# EAGLE schematic C1 (EAGLE 7.5.0)

## Sheet 1 of 2: Schematic1/2
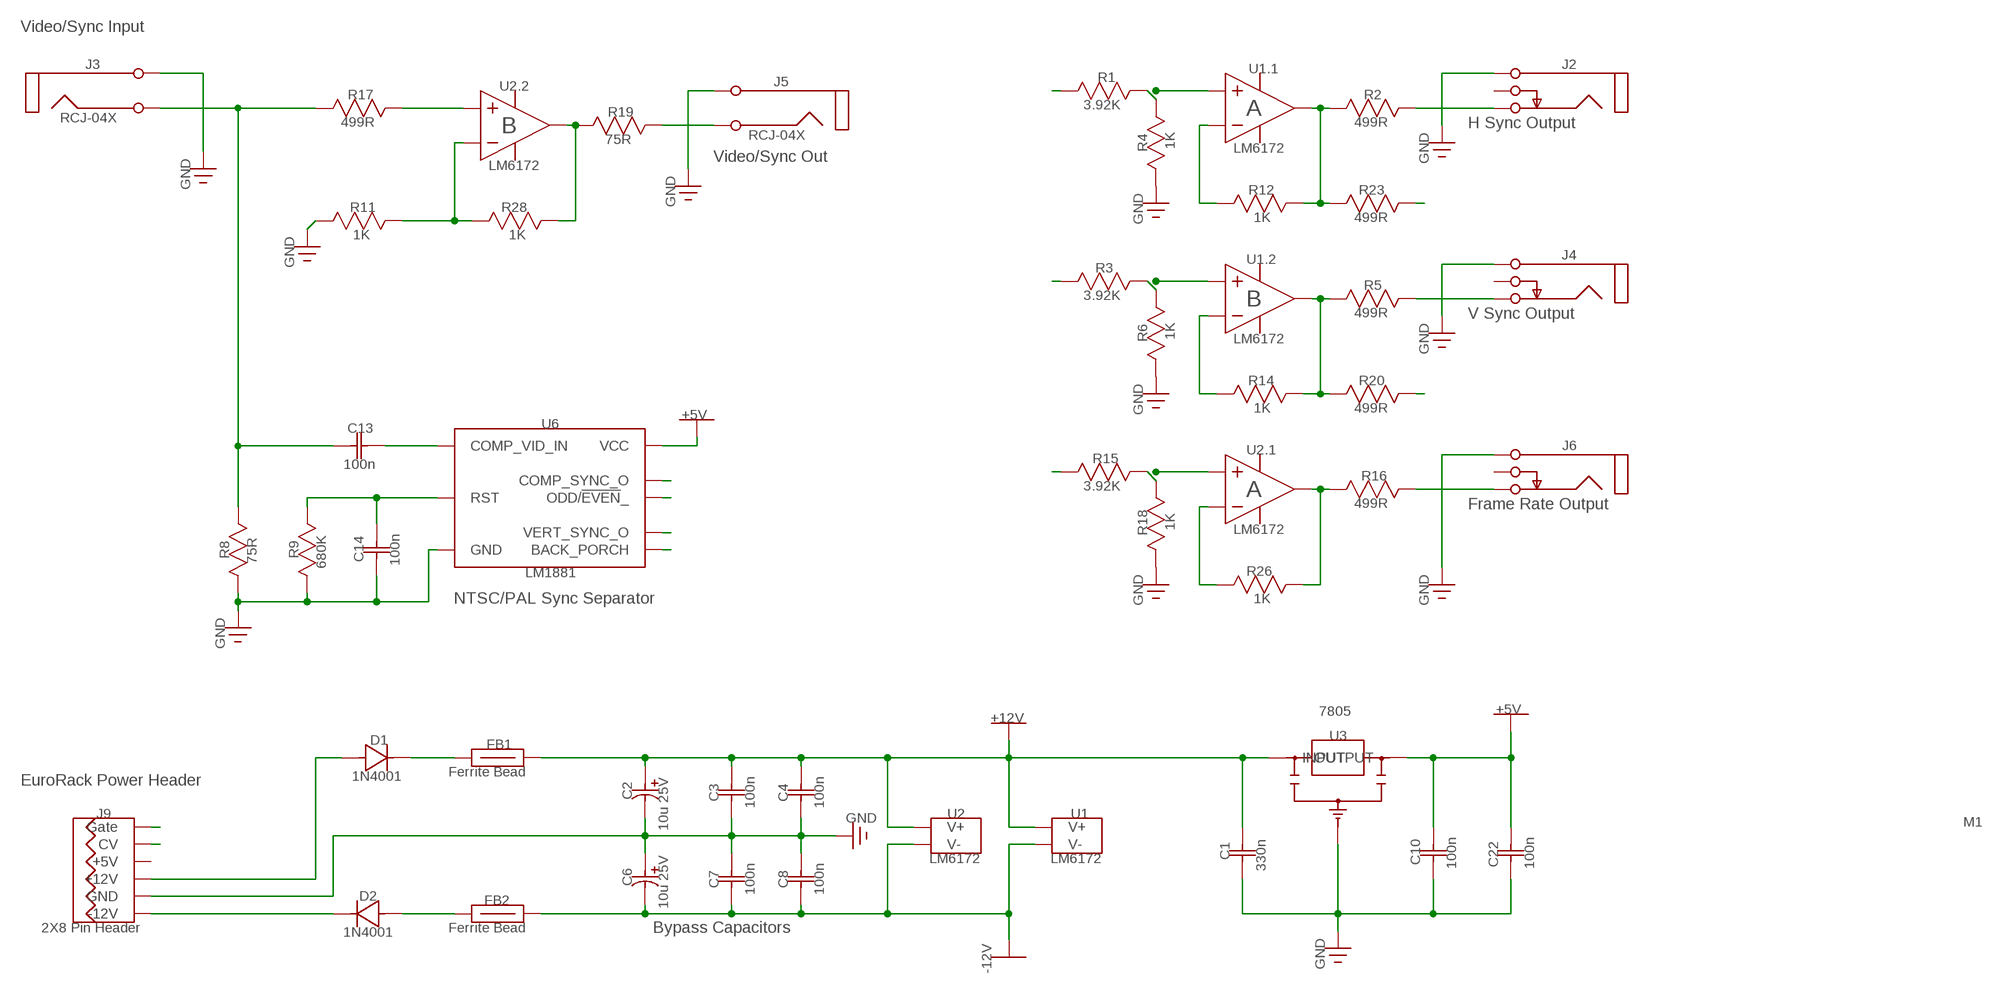
[diagram p0: schematic, sheet 1]

### Parts
C1  330n  CAP100  [CAP-2.54/6.6X3]
C2  10u 25V  EC80-5  [CAPPR-2/5.08]
C3  100n  CAP100  [CAP-2.54/6.6X3]
C4  100n  CAP100  [CAP-2.54/6.6X3]
C6  10u 25V  EC80-5  [CAPPR-2/5.08]
C7  100n  CAP100  [CAP-2.54/6.6X3]
C8  100n  CAP100  [CAP-2.54/6.6X3]
C10  100n  CAP100  [CAP-2.54/6.6X3]
C13  100n  CAP100  [CAP-2.54/6.6X3]
C14  100n  CAP100  [CAP-2.54/6.6X3]
C22  100n  CAP100  [CAP-2.54/6.6X3]
D1  1N4001  [DO-41]
D2  1N4001  [DO-41]
FB1  68R  FERRITE_BEAD  [FB-10.16/4.45X3.5]
FB2  68R  FERRITE_BEAD  [FB-10.16/4.45X3.5]
J2  3.5MM_JACK  [PJ302M]
J3  RCJ-04X  [RCJ-04X]
J4  3.5MM_JACK  [PJ302M]
J5  RCJ-04X_23  [RCJ-04X]
J6  3.5MM_JACK  [PJ302M]
J9  2X8_PIN_HEADER  [IDC16M]
M1  KEYSTONE621  [KEYSTONE621]
R1  3.92K  RES300  [RES-7.62/5.1X2.5]
R2  499R  RES300  [RES-7.62/5.1X2.5]
R3  3.92K  RES300  [RES-7.62/5.1X2.5]
R4  1K  RES300  [RES-7.62/5.1X2.5]
R5  499R  RES300  [RES-7.62/5.1X2.5]
R6  1K  RES300  [RES-7.62/5.1X2.5]
R8  75R  RES300  [RES-7.62/5.1X2.5]
R9  680K  RES300  [RES-7.62/5.1X2.5]
R11  1K  RES300  [RES-7.62/5.1X2.5]
R12  1K  RES300  [RES-7.62/5.1X2.5]
R14  1K  RES300  [RES-7.62/5.1X2.5]
R15  3.92K  RES300  [RES-7.62/5.1X2.5]
R16  499R  RES300  [RES-7.62/5.1X2.5]
R17  499R  RES300  [RES-7.62/5.1X2.5]
R18  1K  RES300  [RES-7.62/5.1X2.5]
R19  75R  RES300  [RES-7.62/5.1X2.5]
R20  499R  RES300  [RES-7.62/5.1X2.5]
R23  499R  RES300  [RES-7.62/5.1X2.5]
R26  1K  RES300  [RES-7.62/5.1X2.5]
R28  1K  RES300  [RES-7.62/5.1X2.5]
U1  LM6172  [DIP-8]
U2  LM6172  [DIP-8]
U3  7805  [TO-220H]
U6  LM1881  [DIP-8_12]

### Nets
0V: C1.2 C2.2(MINUS) C3.2 C4.2 C6.1(PLUS) C7.1 C8.1 C10.2 C14.1 C22.2 J2.1A(Sleeve) J2.1B(Sleeve) J3.1(Sleeve) J4.1A(Sleeve) J4.1B(Sleeve) J5.1(Sleeve) J6.1A(Sleeve) J6.1B(Sleeve) J9.3(GND) J9.4(GND) J9.5(GND) R4.1(A) R6.1(A) R8.1(A) R9.1(A) R11.1(A) R18.1(A) U3.2(GND) U6.4(GND) ; supply symbol labelled GND ; also sheet 2
+5V: C10.1 C22.1 U3.3(OUTPUT) U6.8(VCC) ; also sheet 2
+12V: C1.1 C2.1(PLUS) C3.1 C4.1 FB1.2 U1.8(VCC_AND_GND:V+) U2.8(VCC_AND_GND:V+) U3.1(INPUT)
-12V: C6.2(MINUS) C7.2 C8.2 FB2.2 U1.4(VCC_AND_GND:V-) U2.4(VCC_AND_GND:V-)
ATMEGA88_HSYNC_INV: R1.1(A) ; also sheet 2
ATMEGA88_ODDEVEN: R15.1(A) ; also sheet 2
ATMEGA88_VSYNC_INV: R3.1(A) ; also sheet 2
HSYNC_BUS_OUT: J9.13(CV) J9.14(CV) R23.2(B)
LM1881_BURSTGATE: U6.5(BACK_PORCH)
LM1881_CSYNC: U6.1(COMP_SYNC_O) ; also sheet 2
LM1881_ODDEVEN: U6.7(ODD/!EVEN!_) ; also sheet 2
LM1881_VSYNC: U6.3(VERT_SYNC_O) ; also sheet 2
Net_0: J5.2(Tip) R19.2(B)
Net_1: D2.2(A) FB2.1
Net_2: D1.1(K) FB1.1
Net_3: R14.1(A) U1.6(PART_2:IN-)
Net_4: C13.2 U6.2(COMP_VID_IN)
Net_5: D2.1(K) J9.1(-12V) J9.2(-12V)
Net_6: R3.2(B) R6.2(B) U1.5(PART_2:IN+)
Net_7: J4.3A(Tip) J4.3B(Tip) R5.2(B)
Net_9: R1.2(B) R4.2(B) U1.3(PART_1:IN+)
Net_11: J2.3A(Tip) J2.3B(Tip) R2.2(B)
Net_12: R5.1(A) R14.2(B) R20.1(A) U1.7(PART_2:OUT)
Net_14: R11.2(B) R28.1(A) U2.6(PART_2:IN-)
Net_19: R15.2(B) R18.2(B) U2.3(PART_1:IN+)
Net_20: J6.3A(Tip) J6.3B(Tip) R16.2(B)
Net_21: R26.1(A) U2.2(PART_1:IN-)
Net_22: R16.1(A) R26.2(B) U2.1(PART_1:OUT)
Net_24: R17.2(B) U2.5(PART_2:IN+)
Net_27: R19.1(A) R28.2(B) U2.7(PART_2:OUT)
Net_33: D1.2(A) J9.9(+12V) J9.10(+12V)
Net_34: C13.1 J3.2(Tip) R8.2(B) R17.1(A)
Net_35: C14.2 R9.2(B) U6.6(RST)
Net_52: R12.1(A) U1.2(PART_1:IN-)
Net_53: R2.1(A) R12.2(B) R23.1(A) U1.1(PART_1:OUT)
VSYNC_BUS_OUT: J9.15(Gate) J9.16(Gate) R20.2(B)
Unconnected: J2.2A(Switch) J2.2B(Switch) J4.2A(Switch) J4.2B(Switch) J6.2A(Switch) J6.2B(Switch) J9.11(+5V) J9.12(+5V)

### Notes on the sheet
- Video/Sync Input
- J3 | J2
- U1.1
- R1
- J5
- U2.2
- R17 | 3.92K | A | R2
- RCJ-04X
- 499R | B | R19 | 499R | H Sync Output
- RCJ-04X
- 75R
- LM6172
- Video/Sync Out | R4 | 1K
- LM6172 | GND
- GND
- R12 | R23
- GND
- R11 | R28 | 1K | 499R
- GND
- 1K | 1K
- J4
- GND | U1.2
- R3
- 3.92K | B | R5
- 499R | V Sync Output
- LM6172
- R6 | 1K
- GND
- R14 | R20
- 1K | 499R
- GND
- +5V
- U6
- C13
- J6
- U2.1
- 100n
- R15
- 3.92K | A | R16
- 499R | Frame Rate Output
- LM6172
- 1K
- R18
- R8 | R9 | C14
- 75R | 100n | LM1881
- 680K
- R26
- NTSC/PAL Sync Separator | 1K
- GND | GND
- GND
- 7805
- +5V
- +12V
- U3
- D1
- FB1
- Ferrite Bead
- EuroRack Power Header | 1N4001
- C2 | C3 | C4
- 100n | 100n
- J9 | U2 | U1
- GND | M1
- 10u 25V
- LM6172 | LM6172
- C1
- C10 | C22
- 330n | 100n | 100n
- C6 | C7 | C8
- 100n | 100n
- D2
- FB2 | 10u 25V
- 2X8 Pin Header | Ferrite Bead | Bypass Capacitors
- 1N4001
- GND
- -12V

## Sheet 2 of 2: Schematic2/2
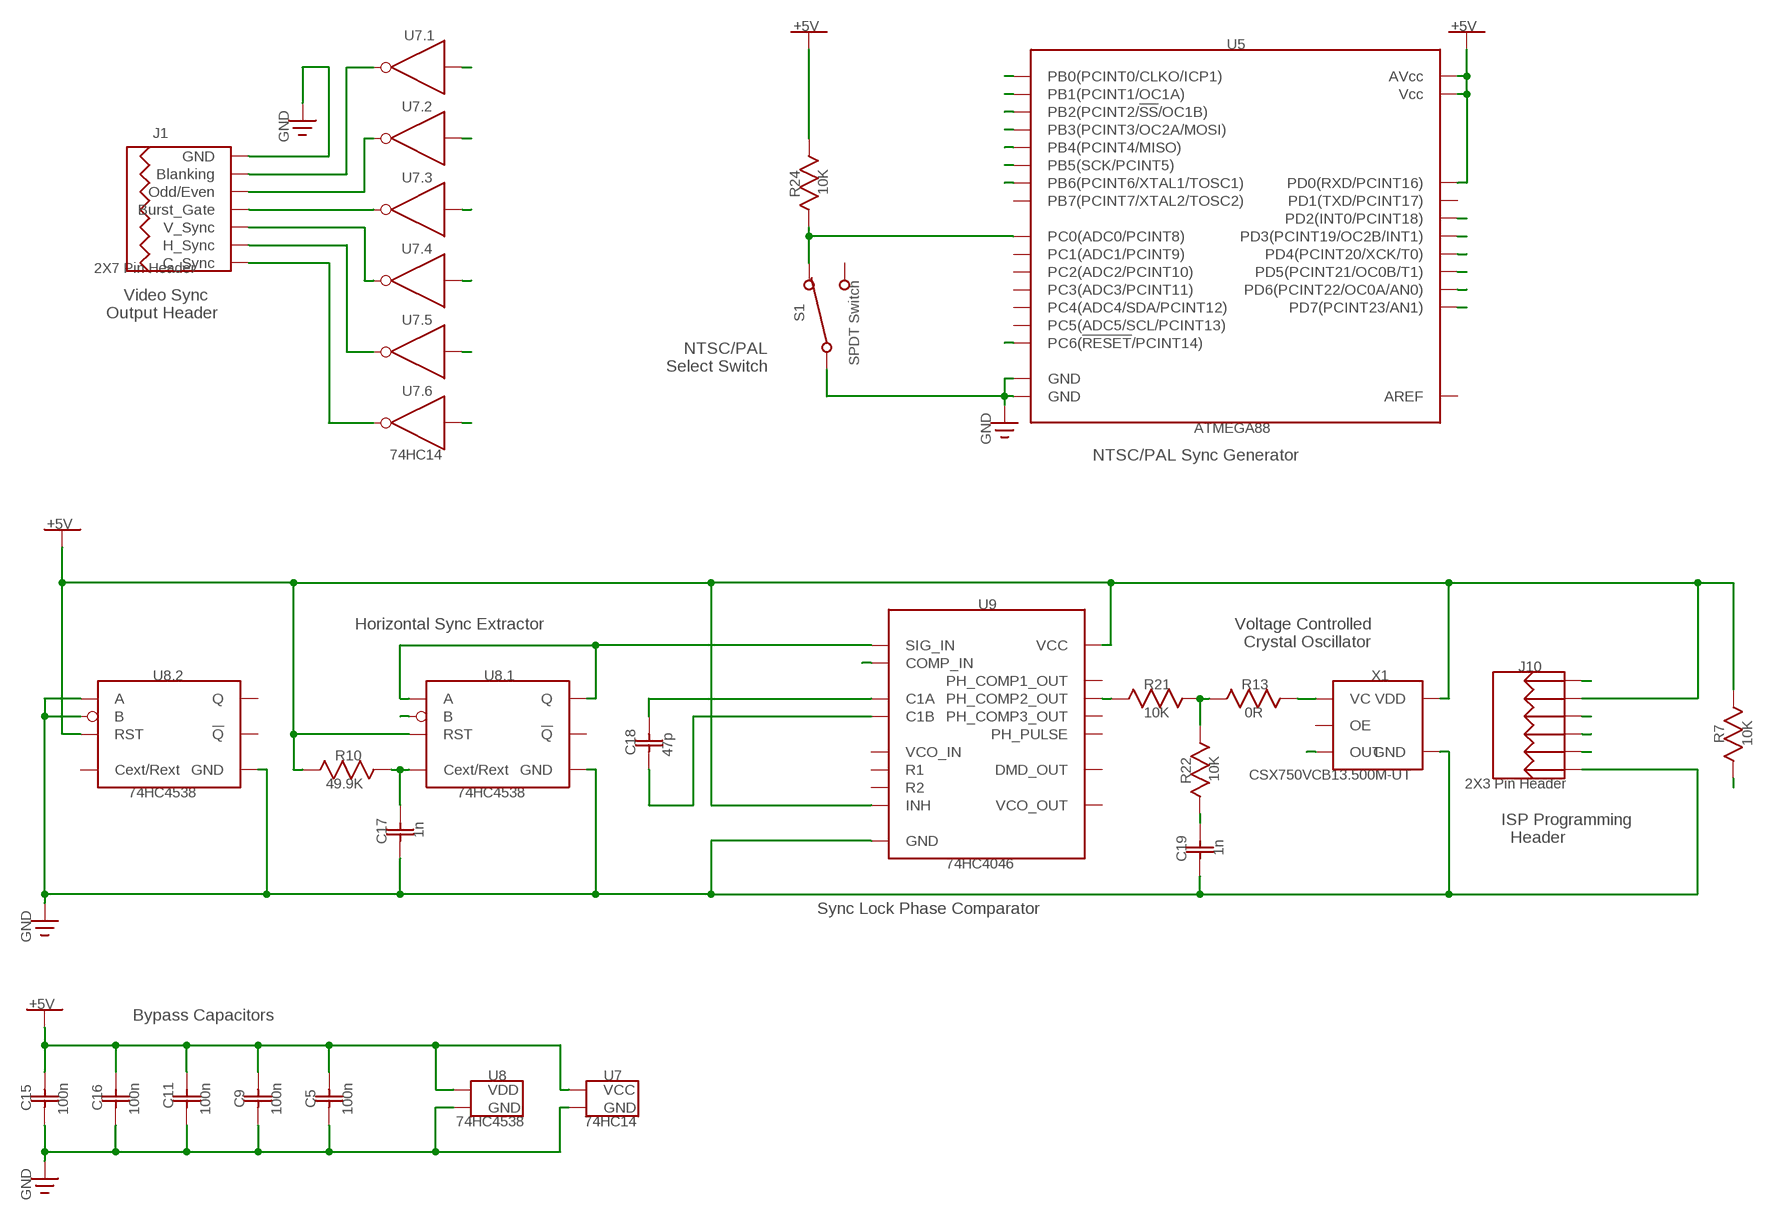
[diagram p1: schematic, sheet 2]

### Parts
C5  100n  CAP100  [CAP-2.54/6.6X3]
C9  100n  CAP100  [CAP-2.54/6.6X3]
C11  100n  CAP100  [CAP-2.54/6.6X3]
C15  100n  CAP100  [CAP-2.54/6.6X3]
C16  100n  CAP100  [CAP-2.54/6.6X3]
C17  1n  CAP100  [CAP-2.54/6.6X3]
C18  47p  CAP100  [CAP-2.54/6.6X3]
C19  1n  CAP100  [CAP-2.54/6.6X3]
J1  2X7_PIN_HEADER  [IDC14M]
J10  2X3_PIN_HEADER  [HDR-2X3T/2.54X2.54/8X5]
R7  10K  RES300  [RES-7.62/5.1X2.5]
R10  49.9K  RES300  [RES-7.62/5.1X2.5]
R13  0R  RES300  [RES-7.62/5.1X2.5]
R21  10K  RES300  [RES-7.62/5.1X2.5]
R22  10K  RES300  [RES-7.62/5.1X2.5]
R24  10K  RES300  [RES-7.62/5.1X2.5]
S1  SPDT_SWITCH  [10TF230-DIY]
U5  ATMEGA88  [DIP-28]
U7  74HC14  [DIP-14]
U8  74HC4538  [DIP-16]
U9  74HC4046  [DIP-16]
X1  CSX750VCB13.500M-UT  [CSX-750V]

### Nets
0V: C5.2 C9.2 C11.2 C15.2 C16.2 C17.2 C19.2 J1.1(GND) J1.2(GND) J10.6 S1.2(C1) S1.2B(C1) U5.8(GND) U5.22(GND) U7.7(VCC_AND_GND:GND) U8.1(PART_1:GND) U8.8(VCC_AND_GND:GND) U8.11(PART_2:B) U8.12(PART_2:A) U8.15(PART_2:GND) U9.8(GND) X1.3(GND) ; supply symbol labelled GND ; also sheet 1
+5V: C5.1 C9.1 C11.1 C15.1 C16.1 J10.2 R7.2(B) R10.2(B) R24.1(A) U5.2(PD0(RXD/PCINT16)) U5.7(Vcc) U5.20(AVcc) U7.14(VCC_AND_GND:VCC) U8.3(PART_1:RST) U8.13(PART_2:RST) U8.16(VCC_AND_GND:VDD) U9.5(INH) U9.16(VCC) X1.6(VDD) ; also sheet 1
ATMEGA88_BLANKING_INV: U5.11(PD5(PCINT21/OC0B/T1)) U7.1(PART_1:A)
ATMEGA88_BURSTGATE_INV: U5.5(PD3(PCINT19/OC2B/INT1)) U7.5(PART_3:A)
ATMEGA88_CSYNC_INV: U5.16(PB2(PCINT2/!SS!/OC1B)) U7.13(PART_6:A)
ATMEGA88_HSYNC_INV: U5.15(PB1(PCINT1/OC1A)) U7.11(PART_5:A) U9.3(COMP_IN) ; also sheet 1
ATMEGA88_MISO: J10.1 U5.18(PB4(PCINT4/MISO))
ATMEGA88_MOSI: J10.4 U5.17(PB3(PCINT3/OC2A/MOSI))
ATMEGA88_ODDEVEN: U5.12(PD6(PCINT22/OC0A/AN0)) ; also sheet 1
ATMEGA88_ODDEVEN_INV: U5.14(PB0(PCINT0/CLKO/ICP1)) U7.3(PART_2:A)
ATMEGA88_RESET: J10.5 R7.1(A) U5.1(PC6(!RESET!/PCINT14))
ATMEGA88_SCK: J10.3 U5.19(PB5(SCK/PCINT5))
ATMEGA88_VSYNC_INV: U5.13(PD7(PCINT23/AN1)) U7.9(PART_4:A) ; also sheet 1
CLOCK_OUT: U5.9(PB6(PCINT6/XTAL1/TOSC1)) X1.4(OUT)
LM1881_CSYNC: U8.5(PART_1:B) ; also sheet 1
LM1881_ODDEVEN: U5.6(PD4(PCINT20/XCK/T0)) ; also sheet 1
LM1881_VSYNC: U5.4(PD2(INT0/PCINT18)) ; also sheet 1
Net_15: J1.3(Blanking) J1.4(Blanking) U7.2(PART_1:Y)
Net_16: J1.5(Odd/Even) J1.6(Odd/Even) U7.4(PART_2:Y)
Net_40: U8.4(PART_1:A) U8.6(PART_1:Q) U9.14(SIG_IN)
Net_41: C17.1 R10.1(A) U8.2(PART_1:Cext/Rext)
Net_42: C18.1 U9.6(C1A)
Net_43: C18.2 U9.7(C1B)
Net_44: C19.1 R22.2(B)
Net_45: R13.2(B) R21.2(B) R22.1(A)
Net_46: R21.1(A) U9.13(PH_COMP2_OUT)
Net_47: J1.7(Burst_Gate) J1.8(Burst_Gate) U7.6(PART_3:Y)
Net_48: J1.9(V_Sync) J1.10(V_Sync) U7.8(PART_4:Y)
Net_49: J1.11(H_Sync) J1.12(H_Sync) U7.10(PART_5:Y)
Net_50: J1.13(C_Sync) J1.14(C_Sync) U7.12(PART_6:Y)
Net_58: R13.1(A) X1.1(VC)
Net_62: R24.2(B) S1.1(C3) S1.1B(C3) U5.23(PC0(ADC0/PCINT8))
Unconnected: S1.3(C2) S1.3B(C2) U5.3(PD1(TXD/PCINT17)) U5.10(PB7(PCINT7/XTAL2/TOSC2)) U5.21(AREF) U5.24(PC1(ADC1/PCINT9)) U5.25(PC2(ADC2/PCINT10)) U5.26(PC3(ADC3/PCINT11)) U5.27(PC4(ADC4/SDA/PCINT12)) U5.28(PC5(ADC5/SCL/PCINT13)) U8.7(PART_1:!Q) U8.9(PART_2:!Q) U8.10(PART_2:Q) U8.14(PART_2:Cext/Rext) U9.1(PH_PULSE) U9.2(PH_COMP1_OUT) U9.4(VCO_OUT) U9.9(VCO_IN) U9.10(DMD_OUT) U9.11(R1) U9.12(R2) U9.15(PH_COMP3_OUT) X1.5(OE)

### Notes on the sheet
- +5V | +5V
- U7.1
- U5
- U7.2
- J1 | GND
- U7.3
- R24 | 10K
- U7.4
- 2X7 Pin Header
- Video Sync
- Output Header
- U7.5 | S1
- NTSC/PAL
- Select Switch
- SPDT Switch
- U7.6
- ATMEGA88
- GND
- 74HC14 | NTSC/PAL Sync Generator
- +5V
- U9
- Horizontal Sync Extractor | Voltage Controlled
- Crystal Oscillator
- J10
- U8.2 | U8.1 | X1
- R21 | R13
- 10K | 0R
- R7 | 10K
- C18 | 47p
- R10
- CSX750VCB13.500M-UT
- 49.9K | 10K | 2X3 Pin Header
- 74HC4538 | 74HC4538 | R22
- ISP Programming
- Header
- 1n
- C17
- 74HC4046 | 1n
- C19
- Sync Lock Phase Comparator
- GND
- +5V | Bypass Capacitors
- U8 | U7
- C15 | C16 | C11 | C9 | C5
- 100n | 100n | 100n | 100n | 100n | 74HC4538 | 74HC14
- GND

## Library data of the parts
C1 = common:CAP100
C2 C6 = common:EC80-5
C3-C5 C7-C11 C13-C19 C22 = common:CAP100; VALUE: 330n
D1 D2 = common:1N4001
FB1 FB2 = common:FERRITE_BEAD; MANUFACTURER: Fair-Rite
J1 = common:2X7_PIN_HEADER
J2 J4 J6 = common:3.5MM_JACK; DATASHEET: http://www.thonk.co.uk/shop/pj302m/
J3 = common:RCJ-04X
J5 = common:RCJ-04X_23
J9 = common:2X8_PIN_HEADER
J10 = common:2X3_PIN_HEADER; DATASHEET: http://datasheets.diptrace.com\con_headers\901310126_sd.pdf; MANUFACTURER: Molex
M1 = common:KEYSTONE621
R1 R3 R15 = common:RES300
R2 R4-R14 R16-R24 R26 R28 = common:RES300; VALUE: 3.92K
S1 = common:SPDT_SWITCH
U1 U2 = common:LM6172; DATASHEET: http://datasheets.diptrace.com\ti\TL07x.pdf; MANUFACTURER: Texas Instruments
U3 = common:7805; MANUFACTURER: Atmel
U5 = common:ATMEGA88; MANUFACTURER: Atmel
U6 = common:LM1881; MANUFACTURER: National Semiconductor
U7 = common:74HC14; MANUFACTURER: National Semiconductor
U8 = common:74HC4538; MANUFACTURER: Motorola
U9 = common:74HC4046; DATASHEET: http://datasheets.diptrace.com\fairchild\MM74HC4046.pdf; MANUFACTURER: Fairchild
X1 = common:CSX750VCB13.500M-UT